# Altium schematic sheet AUX1.SchDoc
size A4
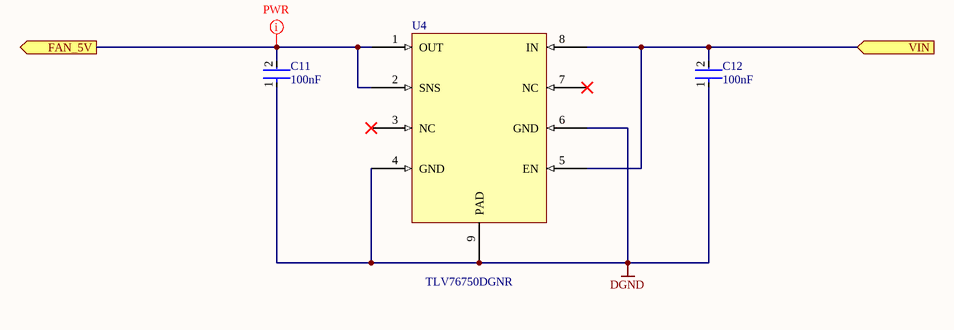
[diagram p0: AUX1.SchDoc]

## Parts
C11  value 100nF  [FP-CC0402-IPC_B]  (hidden comment: CC0402KRX7R9BB104)
C12  value 100nF  [FP-CC0402-IPC_B]  (hidden comment: CC0402KRX7R9BB104)
U4  TLV76750DGNR  [TLV76708DGNR-Footprint-1]

## Ports
FAN_5V (out), VIN (in)

## Nets
DGND: C11.1 C12.1 U4.4(GND) U4.6(GND) U4.9(PAD)
FAN_5V: C11.2 U4.1(OUT) U4.2(SNS) ; port FAN_5V
VIN: C12.2 U4.5(EN) U4.8(IN) ; port VIN

Not connected (* = marked no-connect by the designer): U4 3(NC)* 7(NC)*

## Layout directives
net class PWR: FAN_5V

## Library data of the parts
C11 C12 = CMP-x00152-1: Ceramic Capacitor, Multilayer, Ceramic, 50V, 10% +Tol, 10% -Tol, X7R, 15% TC, 0.1uF, Surface Mount, 0402
U4 = CMP-x00161-4: Adjustable- and fixed-output, 1-A, 16-V, positive-voltage low-dropout (LDO) linear regulator 8-HVSSOP -40 to 125; Manufacturer: TI; Template: TI_HVSSOP; Reel Width: 12mm; Mounting: SMD; Category: IC; Package: HVSSOP; MOQ: 2500